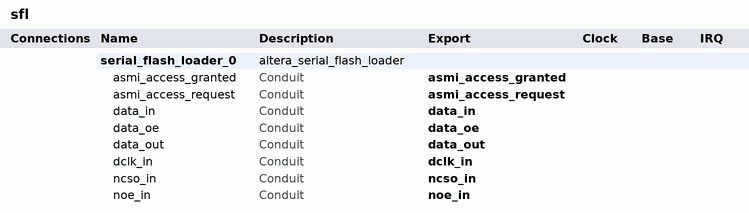
[diagram p0: system contents]
# Platform Designer (Qsys) system sfl, Cyclone V 5CEFA5F23C8
# Parameters at their usual value, and those the tool derives, are not listed.
package require -exact qsys 23.1
create_system sfl
set_project_property DEVICE_FAMILY {Cyclone V}
set_project_property DEVICE 5CEFA5F23C8

add_instance serial_flash_loader_0 altera_serial_flash_loader 23.1
set_instance_property serial_flash_loader_0 AUTO_EXPORT true
set_instance_parameter_value serial_flash_loader_0 ENHANCED_MODE true
set_instance_parameter_value serial_flash_loader_0 gui_shared_access true

# exported interfaces
add_interface asmi_access_granted conduit end
set_interface_property asmi_access_granted EXPORT_OF serial_flash_loader_0.asmi_access_granted
add_interface asmi_access_request conduit end
set_interface_property asmi_access_request EXPORT_OF serial_flash_loader_0.asmi_access_request
add_interface data_in conduit end
set_interface_property data_in EXPORT_OF serial_flash_loader_0.data_in
add_interface data_oe conduit end
set_interface_property data_oe EXPORT_OF serial_flash_loader_0.data_oe
add_interface data_out conduit end
set_interface_property data_out EXPORT_OF serial_flash_loader_0.data_out
add_interface dclk_in conduit end
set_interface_property dclk_in EXPORT_OF serial_flash_loader_0.dclk_in
add_interface ncso_in conduit end
set_interface_property ncso_in EXPORT_OF serial_flash_loader_0.ncso_in
add_interface noe_in conduit end
set_interface_property noe_in EXPORT_OF serial_flash_loader_0.noe_in

set_interconnect_requirement {$system} qsys_mm.clockCrossingAdapter HANDSHAKE
set_interconnect_requirement {$system} qsys_mm.enableEccProtection FALSE
set_interconnect_requirement {$system} qsys_mm.insertDefaultSlave FALSE
set_interconnect_requirement {$system} qsys_mm.maxAdditionalLatency 1

save_system sfl.qsys
